# Altium schematic sheet Generador De Retardo.SchDoc
size A4
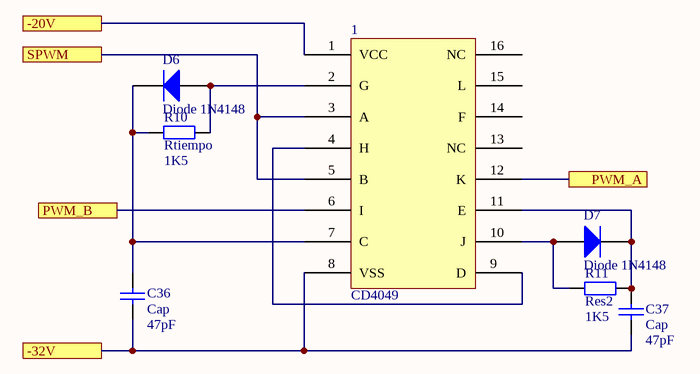
[diagram p0: Generador De Retardo.SchDoc]

## Parts
1  CD4049  [PDIP16]
C36  Cap  value 47pF  [CAP DISCO 200mil]
C37  Cap  value 47pF  [CAP DISCO 200mil]
D6  Diode 1N4148  [SOD323-F]
D7  Diode 1N4148  [SOD323-F]
R10  Rtiempo  value 1K5  [1206 resistor]
R11  Res2  value 1K5  [1206 resistor]

## Ports
-20V, -32V, PWM_A, PWM_B, SPWM

## Nets
-20V: 1.1(VCC) ; port -20V
-32V: 1.8(VSS) C36.1 C37.1 ; port -32V
PWM_A: 1.12(K) ; port PWM_A
PWM_B: 1.6(I) ; port PWM_B
SPWM: 1.3(A) 1.5(B) ; port SPWM
Net1_2: 1.2(G) D6.1(A) R10.2
Net1_4: 1.4(H) 1.9(D)
Net1_7: 1.7(C) C36.2 D6.2(K) R10.1
Net1_10: 1.10(J) D7.1(A) R11.1
Net1_11: 1.11(E) C37.2 D7.2(K) R11.2

Not connected (* = marked no-connect by the designer): 1 13(NC) 14(F) 15(L) 16(NC)

## Library data of the parts
C36 C37 = Cap: Capacitor; Published: 8-Jun-2000; LatestRevisionDate: 17-Jul-2002; LatestRevisionNote: Re-released for DXP Platform.; PackageReference: RAD-0.3; Publisher: Altium Limited; PackageDescription: Radial Cap, Thru-Hole; 2 Leads; 0.3 in Pin Spacing
D6 D7 = Diode 1N4148: High Conductance Fast Diode; Published: 8-Jun-2000; LatestRevisionDate: 17-Jul-2002; LatestRevisionNote: Re-released for DXP Platform.; DatasheetVersion: 1997; PackageReference: DO-35; Publisher: Altium Limited; PackageDescription: Diode, Axial; Body 3.8 x 1.9 mm (LxDia. max), Lead Dia. 0.53 mm (max); Code_JEDEC: DO-204-AH; ComponentLink1Description: Manufacturer Link; ComponentLink1URL: http://www.fairchildsemi.com/; ComponentLink2Description: Datasheet; ComponentLink2URL: http://www.fairchildsemi.com/ds/1N%2F1N4148.pdf
R10 R11 = Res2: Resistor; Published: 8-Jun-2000; LatestRevisionDate: 17-Jul-2002; LatestRevisionNote: Re-released for DXP Platform.; PackageReference: AXIAL-0.4; Publisher: Altium Limited; PackageDescription: Axial Device, Thru-Hole; 2 Leads; 0.4 in Pin Spacing